# EAGLE schematic uart_rs232_adapter (EAGLE 9.4.2)
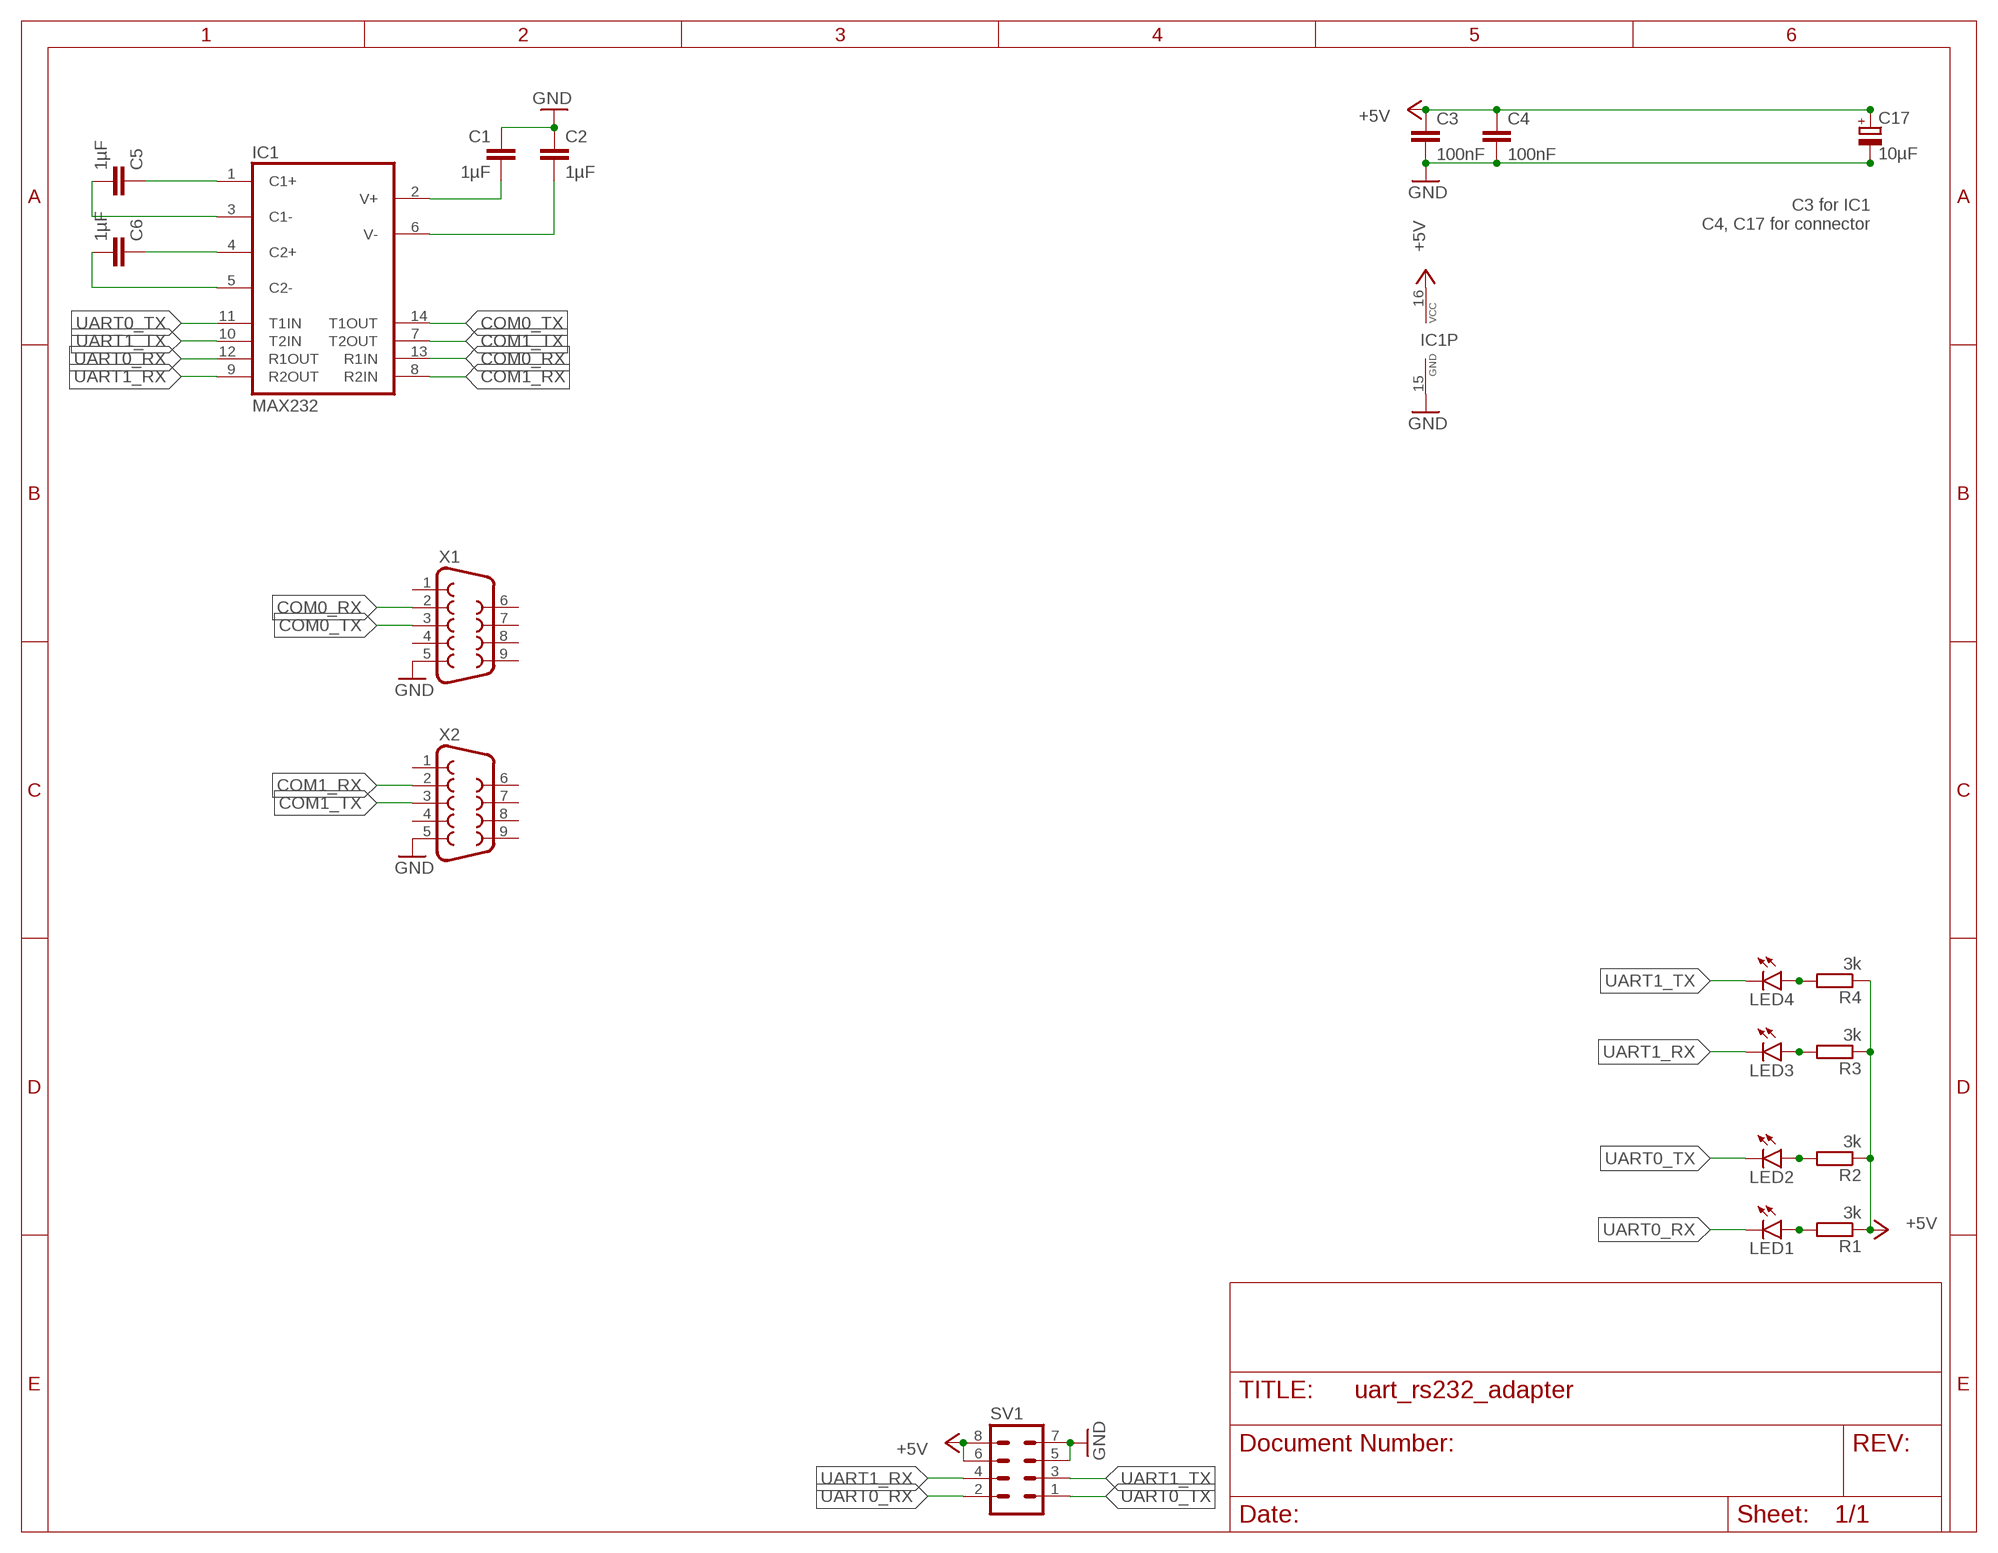
[diagram p0: schematic, sheet 1]

## Parts
C1  1µF  C-EUC0805  [C0805]
C2  1µF  C-EUC0805  [C0805]
C3  100nF  C-EUC0805  [C0805]
C4  100nF  C-EUC0805  [C0805]
C5  1µF  C-EUC0805  [C0805]
C6  1µF  C-EUC0805  [C0805]
C17  10µF  CPOL-EUSMCB  [SMC_B]
IC1  MAX232  [DIL16]
LED1  LEDCHIPLED_1206  [CHIPLED_1206]
LED2  LEDCHIPLED_1206  [CHIPLED_1206]
LED3  LEDCHIPLED_1206  [CHIPLED_1206]
LED4  LEDCHIPLED_1206  [CHIPLED_1206]
R1  3k  R-EU_R2012  [R2012]
R2  3k  R-EU_R2012  [R2012]
R3  3k  R-EU_R2012  [R2012]
R4  3k  R-EU_R2012  [R2012]
SV1  MA04-2  [MA04-2]
X1  F09HP  [F09HP]
X2  F09HP  [F09HP]

## Nets
+5V: C3.1 C4.1 C17.+ IC1.16(VCC) R1.1 R2.1 R3.1 R4.1 SV1.6 SV1.8
COM0_RX: IC1.13(R1IN) X1.2
COM0_TX: IC1.14(T1OUT) X1.3
COM1_RX: IC1.8(R2IN) X2.2
COM1_TX: IC1.7(T2OUT) X2.3
GND: C1.1 C2.1 C3.2 C4.2 C17.- IC1.15(GND) SV1.5 SV1.7 X1.5 X2.5
N$1: LED1.A R1.2
N$2: LED2.A R2.2
N$3: LED3.A R3.2
N$5: LED4.A R4.2
N$6: C1.2 IC1.2(V+)
N$7: C2.2 IC1.6(V-)
N$8: C6.1 IC1.4(C2+)
N$9: C5.1 IC1.1(C1+)
N$10: C5.2 IC1.3(C1-)
N$11: C6.2 IC1.5(C2-)
UART0_RX: IC1.12(R1OUT) LED1.C SV1.2
UART0_TX: IC1.11(T1IN) LED2.C SV1.1
UART1_RX: IC1.9(R2OUT) LED3.C SV1.4
UART1_TX: IC1.10(T2IN) LED4.C SV1.3
Unconnected: X1.1 X1.4 X1.6 X1.7 X1.8 X1.9 X2.1 X2.4 X2.6 X2.7 X2.8 X2.9

## Notes on the sheet
- C3 for IC1
  C4, C17 for connector

## Library data of the parts
C1 C2 C5 C6 = rcl:C-EU: CAPACITOR, European symbol; MOUSER: 710-885012207078; SPICEPREFIX: C
C3 C4 = rcl:C-EU: CAPACITOR, European symbol; MOUSER: 710-885012207072; SPICEPREFIX: C
C17 = rcl:CPOL-EU: POLARIZED CAPACITOR, European symbol; MOUSER: 581-TAJB106K020RNJV; SPICEPREFIX: C
IC1 = maxim:MAX232: RS232 TRANSCEIVER; MF: MAXIM; MPN: MAX232ACPE+; OC_FARNELL: 9723773; OC_NEWARK: 68K4544
LED1-LED4 = led:LED: LED OSRAM: - CHIPLED LG R971, LG N971, LY N971, LG Q971, LY Q971, LO R971, LY R971 LH N974, LH R974 LS Q976, LO Q976, LY Q976 LO Q996 - Hyper CHIPLED LW Q18S LB Q993, LB Q99A, LB R99A - SideLED LS A670, LO A670, LY A670, LG A670, LP A670 LB A673, LV A673, LT A673, LW A673 LH A674 LY A675 LS A676, LA A676, LO A676, LY A676, LW A676 LS A679, LY A679, LG A679 - Hyper Micro SIDELED® LS Y876, LA Y876, LO Y876, LY Y876 LT Y87S - SmartLED LW L88C, LW L88S LB L89C, LB L89S, LG L890 LS L89K, LO L89K, LY L89K LS L896, LA L896, LO L896, LY L896 - TOPLED LS T670, LO T670, LY T670, LG T670, LP T670 LSG T670, LSP T670, LSY T670, LOP T670, LYG T670 LG T671, LOG T671, LSG T671 LB T673, LV T673, LT T673, LW T673 LH T674 LS T676, LA T676, LO T676, LY T676, LB T676, LH T676, LSB T676, LW T676 LB T67C, LV T67C, LT T67C, LS T67K, LO T67K, LY T67K, LW E67C LS E67B, LA E67B, LO E67B, LY E67B, LB E67C, LV E67C, LT E67C LW T67C LS T679, LY T679, LG T679 LS T770, LO T770, LY T770, LG T770, LP T770 LB T773, LV T773, LT T773, LW T773 LH T774 LS E675, LA E675, LY E675, LS T675 LS T776, LA T776, LO T776, LY T776, LB T776 LHGB T686 LT T68C, LB T68C - Hyper Mini TOPLED® LB M676 - Mini TOPLED Santana® LG M470 LS M47K, LO M47K, LY M47K Source: http://www.osram.convergy.de LUXEON: - LUMILED® LXK2-PW12-R00, LXK2-PW12-S00, LXK2-PW14-U00, LXK2-PW14-V00 LXK2-PM12-R00, LXK2-PM12-S00, LXK2-PM14-U00 LXK2-PE12-Q00, LXK2-PE12-R00, LXK2-PE12-S00, LXK2-PE14-T00, LXK2-PE14-U00 LXK2-PB12-K00, LXK2-PB12-L00, LXK2-PB12-M00, LXK2-PB14-N00, LXK2-PB14-P00, LXK2-PB14-Q00 LXK2-PR12-L00, LXK2-PR12-M00, LXK2-PR14-Q00, LXK2-PR14-R00 LXK2-PD12-Q00, LXK2-PD12-R00, LXK2-PD12-S00 LXK2-PH12-R00, LXK2-PH12-S00 LXK2-PL12-P00, LXK2-PL12-Q00, LXK2-PL12-R00 Source: www.luxeon.com KINGBRIGHT: KA-3528ASYC Source: www.kingbright.com; MOUSER: 710-156120YS75300
R1-R4 = rcl:R-EU_: RESISTOR, European symbol; MOUSER: 652-CR0805JW-302ELF; SPICEPREFIX: R
SV1 = con-lstb:MA04-2: PIN HEADER; OC_FARNELL: unknown; OC_NEWARK: unknown
X1 X2 = con-subd:F09: SUB-D; OC_FARNELL: unknown; OC_NEWARK: unknown

## Net classes
0 default: width 0.203 mm